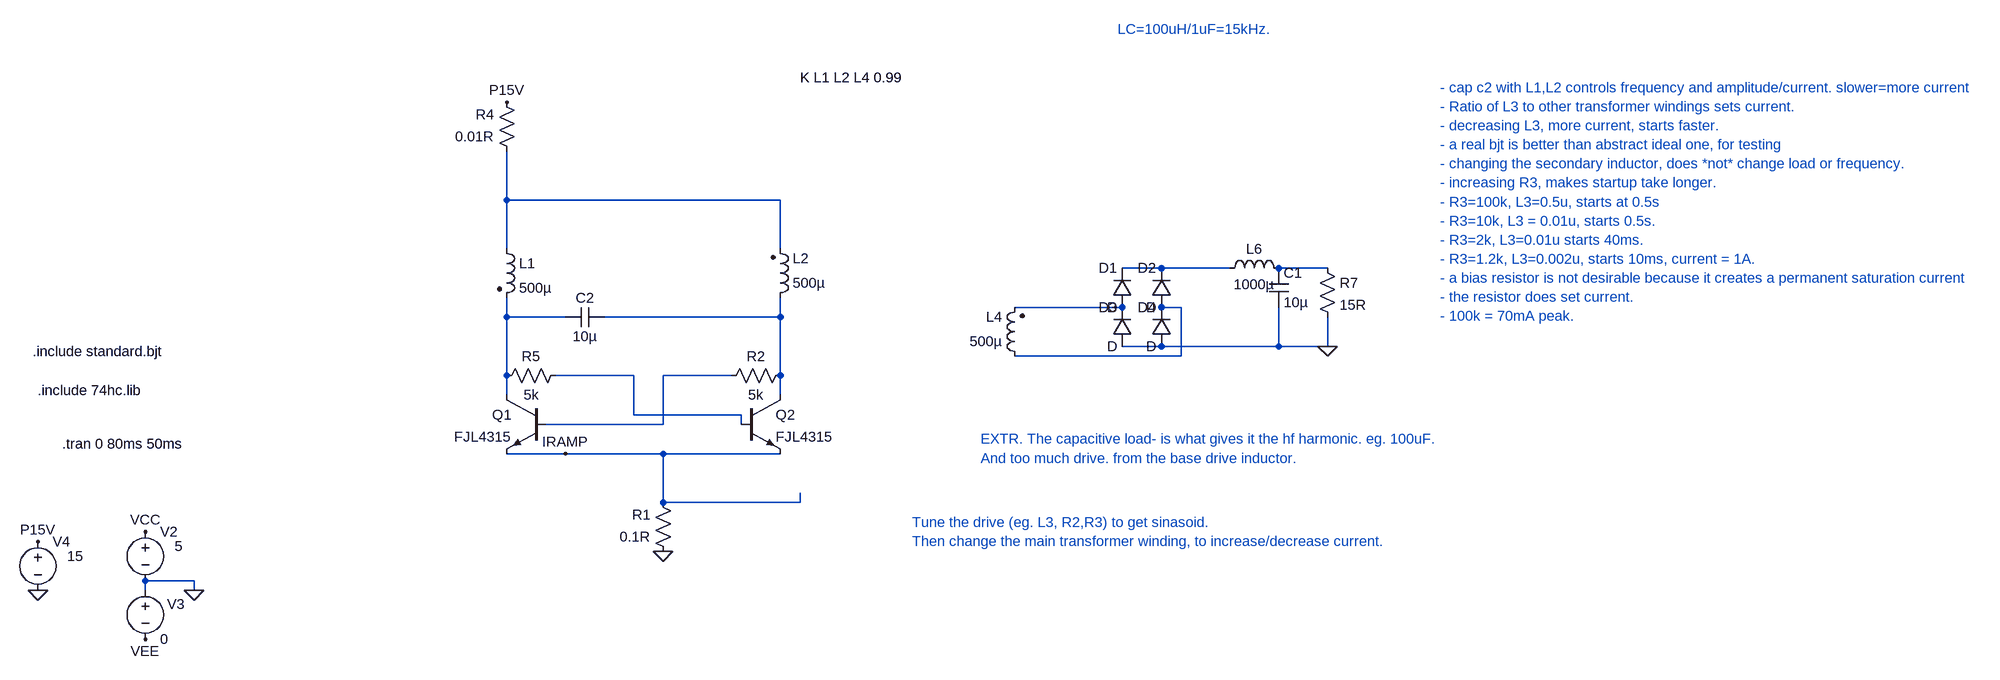
[diagram p0: schematic Draft76.asc]
Draft76.asc, the LTspice schematic file:
Version 4
SHEET 1 3924 1268
WIRE 1424 -672 1424 -752
WIRE 1872 -672 1424 -672
WIRE 1424 -592 1424 -672
WIRE 1872 -592 1872 -672
WIRE 2496 -560 2432 -560
WIRE 2608 -560 2496 -560
WIRE 2768 -560 2688 -560
WIRE 2432 -496 2256 -496
WIRE 2528 -496 2496 -496
WIRE 1424 -480 1424 -512
WIRE 1520 -480 1424 -480
WIRE 1872 -480 1872 -512
WIRE 1872 -480 1584 -480
WIRE 2496 -432 2432 -432
WIRE 2688 -432 2688 -496
WIRE 2688 -432 2496 -432
WIRE 2768 -432 2768 -480
WIRE 2768 -432 2688 -432
WIRE 2528 -416 2528 -496
WIRE 2528 -416 2256 -416
WIRE 1424 -384 1424 -480
WIRE 1632 -384 1504 -384
WIRE 1792 -384 1680 -384
WIRE 1872 -384 1872 -480
WIRE 1424 -352 1424 -384
WIRE 1872 -352 1872 -384
WIRE 1632 -320 1632 -384
WIRE 1808 -320 1632 -320
WIRE 1680 -304 1680 -384
WIRE 1680 -304 1488 -304
WIRE 1808 -304 1808 -320
WIRE 1520 -256 1424 -256
WIRE 1680 -256 1520 -256
WIRE 1872 -256 1680 -256
WIRE 1680 -176 1680 -256
WIRE 1904 -176 1904 -192
WIRE 1904 -176 1680 -176
WIRE 912 -48 832 -48
WIRE 832 -32 832 -48
WIRE 912 -32 912 -48
FLAG 912 -32 0
FLAG 832 -128 VCC
FLAG 832 48 VEE
FLAG 656 -32 0
FLAG 656 -112 P15V
FLAG 1680 -96 0
FLAG 1424 -832 P15V
FLAG 1520 -256 IRAMP
FLAG 2768 -432 0
SYMBOL voltage 832 -144 R0
WINDOW 123 0 0 Left 0
WINDOW 39 0 0 Left 0
WINDOW 3 48 40 Left 2
SYMATTR Value 5
SYMATTR InstName V2
SYMBOL voltage 832 -48 R0
WINDOW 123 0 0 Left 0
WINDOW 39 0 0 Left 0
WINDOW 0 36 39 Left 2
SYMATTR InstName V3
SYMATTR Value 0
SYMBOL voltage 656 -128 R0
WINDOW 123 0 0 Left 0
WINDOW 39 0 0 Left 0
WINDOW 3 48 40 Left 2
SYMATTR Value 15
SYMATTR InstName V4
SYMBOL ind2 1408 -608 R0
SYMATTR InstName L1
SYMATTR Value 500µ
SYMATTR Type ind
SYMBOL npn 1488 -352 M0
SYMATTR InstName Q1
SYMATTR Value FJL4315
SYMBOL ind2 1856 -496 M180
WINDOW 0 36 80 Left 2
WINDOW 3 36 40 Left 2
SYMATTR InstName L2
SYMATTR Value 500µ
SYMATTR Type ind
SYMBOL res 1440 -736 R180
WINDOW 0 36 76 Left 2
WINDOW 3 36 40 Left 2
SYMATTR InstName R4
SYMATTR Value 0.01R
SYMBOL npn 1808 -352 R0
SYMATTR InstName Q2
SYMATTR Value FJL4315
SYMBOL diode 2448 -496 R180
WINDOW 0 24 64 Left 2
WINDOW 3 24 0 Left 2
SYMATTR InstName D1
SYMBOL diode 2512 -496 R180
WINDOW 0 24 64 Left 2
WINDOW 3 24 0 Left 2
SYMATTR InstName D2
SYMBOL diode 2448 -432 R180
WINDOW 0 24 64 Left 2
WINDOW 3 24 0 Left 2
SYMATTR InstName D3
SYMBOL diode 2512 -432 R180
WINDOW 0 24 64 Left 2
WINDOW 3 24 0 Left 2
SYMATTR InstName D4
SYMBOL cap 2672 -560 R0
SYMATTR InstName C1
SYMATTR Value 10µ
SYMBOL res 2752 -576 R0
SYMATTR InstName R7
SYMATTR Value 15R
SYMBOL cap 1584 -496 R90
WINDOW 0 0 32 VBottom 2
WINDOW 3 32 32 VTop 2
SYMATTR InstName C2
SYMATTR Value 10µ
SYMBOL ind2 2272 -400 R180
WINDOW 0 36 80 Left 2
WINDOW 3 36 40 Left 2
SYMATTR InstName L4
SYMATTR Value 500µ
SYMATTR Type ind
SYMBOL ind 2592 -544 R270
WINDOW 0 32 56 VTop 2
WINDOW 3 5 56 VBottom 2
SYMATTR InstName L6
SYMATTR Value 1000µ
SYMBOL res 1696 -80 R180
WINDOW 0 36 76 Left 2
WINDOW 3 36 40 Left 2
SYMATTR InstName R1
SYMATTR Value 0.1R
SYMBOL res 1888 -400 R90
WINDOW 0 0 56 VBottom 2
WINDOW 3 32 56 VTop 2
SYMATTR InstName R2
SYMATTR Value 5k
SYMBOL res 1520 -400 R90
WINDOW 0 0 56 VBottom 2
WINDOW 3 32 56 VTop 2
SYMATTR InstName R5
SYMATTR Value 5k
TEXT 696 -272 Left 2 !.tran 0 80ms 50ms
TEXT 656 -360 Left 2 !.include 74hc.lib
TEXT 1904 -872 Left 2 !K L1 L2 L4 0.99
TEXT 2424 -952 Left 2 ;LC=100uH/1uF=15kHz.
TEXT 2200 -280 Left 2 ;EXTR. The capacitive load- is what gives it the hf harmonic. eg. 100uF.\nAnd too much drive. from the base drive inductor.
TEXT 2952 -856 Left 2 ;- cap c2 with L1,L2 controls frequency and amplitude/current. slower=more current\n- Ratio of L3 to other transformer windings sets current.\n- decreasing L3, more current, starts faster.\n- a real bjt is better than abstract ideal one, for testing\n- changing the secondary inductor, does *not* change load or frequency.\n- increasing R3, makes startup take longer.\n- R3=100k, L3=0.5u, starts at 0.5s\n- R3=10k, L3 = 0.01u, starts 0.5s.\n- R3=2k, L3=0.01u starts 40ms.\n- R3=1.2k, L3=0.002u, starts 10ms, current = 1A.\n- a bias resistor is not desirable because it creates a permanent saturation current\n- the resistor does set current.\n- 100k = 70mA peak.
TEXT 648 -424 Left 2 !.include standard.bjt
TEXT 2088 -144 Left 2 ;Tune the drive (eg. L3, R2,R3) to get sinasoid.\nThen change the main transformer winding, to increase/decrease current.

The netlist it stands for:
* Draft76.asc
V2 VCC 0 5
V3 0 VEE 0
V4 P15V 0 15
L1 N001 N006 500µ
Q1 N006 N009 IRAMP 0 FJL4315
L2 N007 N001 500µ
R4 N001 P15V 0.01R
Q2 N007 N008 IRAMP 0 FJL4315
D1 N004 N002 D
D2 N005 N002 D
D3 0 N004 D
D4 0 N005 D
C1 N003 0 10µ
R7 N003 0 15R
C2 N007 N006 10µ
L4 N005 N004 500µ
L6 N002 N003 1000µ
R1 0 IRAMP 0.1R
R2 N007 N009 5k
R5 N008 N006 5k
.model D D
.lib standard.dio
.model NPN NPN
.model PNP PNP
.lib standard.bjt
.tran 0 80ms 50ms
.include 74hc.lib
K L1 L2 L4 0.99
* LC=100uH/1uF=15kHz.
* EXTR. The capacitive load- is what gives it the hf harmonic. eg. 100uF.
* And too much drive. from the base drive inductor.
* - cap c2 with L1,L2 controls frequency and amplitude/current. slower=more current
* - Ratio of L3 to other transformer windings sets current.
* - decreasing L3, more current, starts faster.
* - a real bjt is better than abstract ideal one, for testing
* - changing the secondary inductor, does *not* change load or frequency.
* - increasing R3, makes startup take longer.
* - R3=100k, L3=0.5u, starts at 0.5s
* - R3=10k, L3 = 0.01u, starts 0.5s.
* - R3=2k, L3=0.01u starts 40ms.
* - R3=1.2k, L3=0.002u, starts 10ms, current = 1A.
* - a bias resistor is not desirable because it creates a permanent saturation current
* - the resistor does set current.
* - 100k = 70mA peak.
.include standard.bjt
* Tune the drive (eg. L3, R2,R3) to get sinasoid.
* Then change the main transformer winding, to increase/decrease current.
.backanno
.end